# Altium project Sitara_Project_Rev_A.PrjPcb (part 3 of 3)
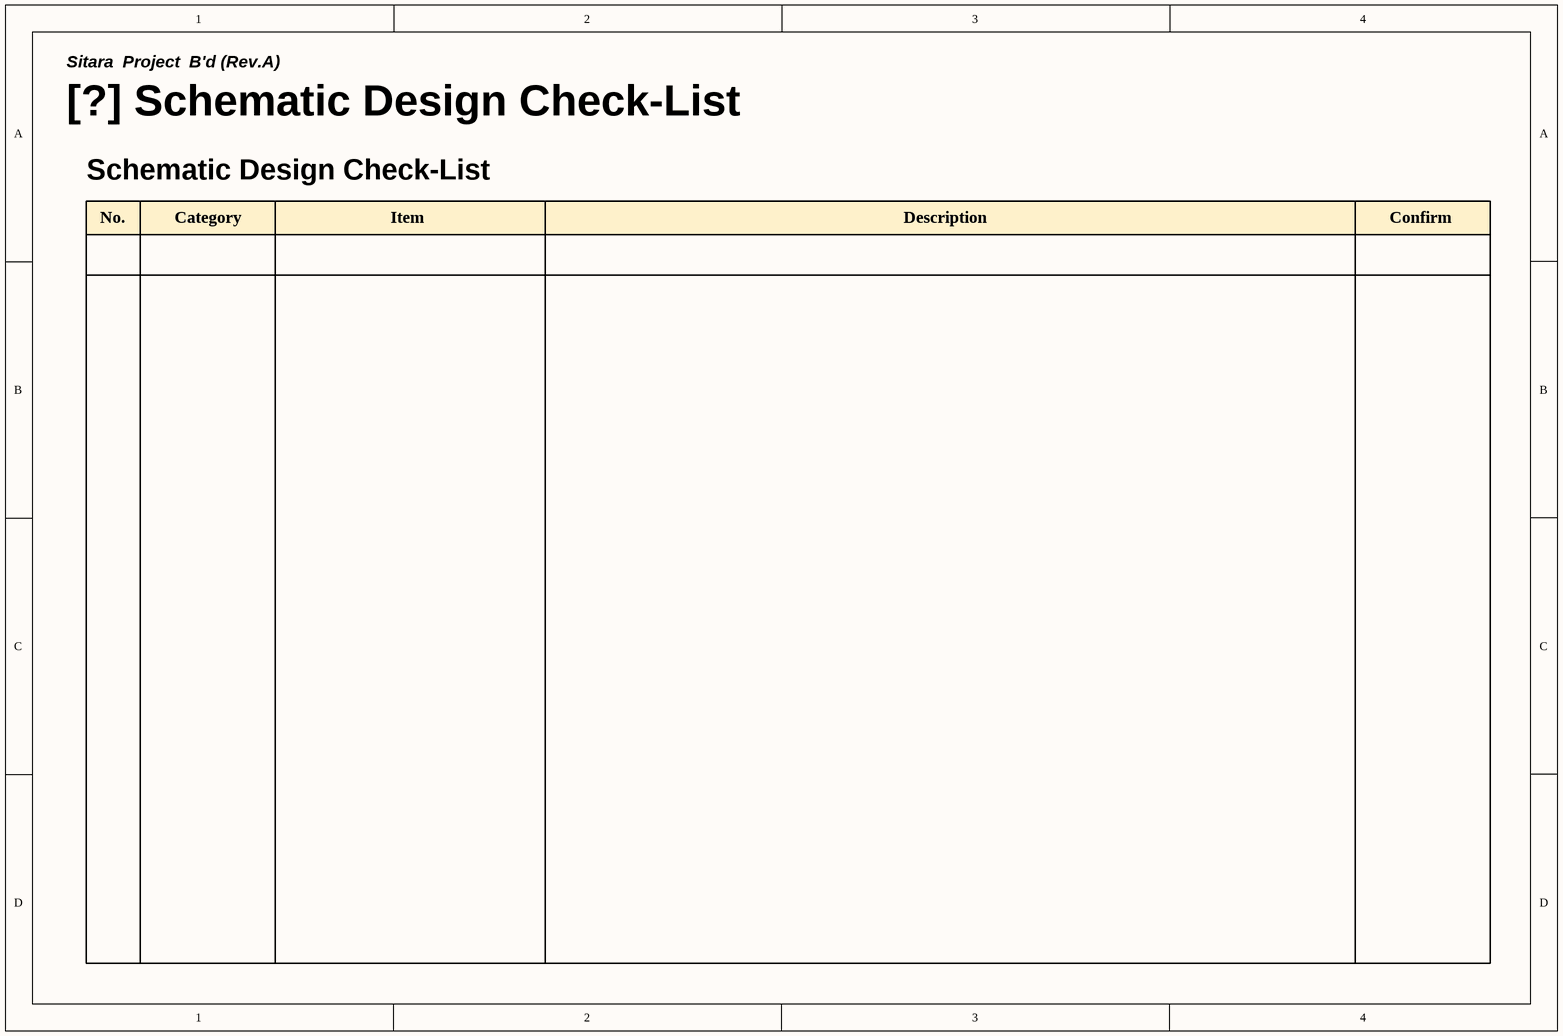
[diagram p11: Sch_Design_Check_List.SchDoc]

## Nets that join several sheets
DGND: Power (46 pins), Sitara_Power (116 pins), Sitara_AUX (34 pins), Sitara_DDR (52 pins), Sitara_IO_Bank_123 (33 pins), Sitara_IO_Bank_45 (36 pins), Sitara_IO_Bank_6 (26 pins), Sitara_Connectors (87 pins)
DP1.1V_CORE: Power (C325.2 R312.2), Sitara_Power (36 pins)
DP1.1V_MPU: Power (C324.2 R311.2), Sitara_Power (13 pins)
DP1.5V_DDR: Power (C323.2 R310.2), Sitara_Power (16 pins), Sitara_DDR (42 pins)
DP1.8V_VDDS: Power (R315.2), Sitara_Power (14 pins)
DP1.8V_VIO: Power (R313.2 U300.18), Sitara_IO_Bank_6 (U902.5)
DP1.8V_VRTC: Power (C326.2 R314.2 R327.2), Sitara_Power (C411.2 U400.D7), Sitara_AUX (C506.2 R553.1 X501.4)
DP1.8VS: Power (C328.2 R317.2), Sitara_Power (9 pins), Sitara_IO_Bank_123 (23 pins)
DP3.3VS_A: Power (6 pins), Sitara_Power (43 pins), Sitara_AUX (20 pins), Sitara_IO_Bank_123 (5 pins), Sitara_IO_Bank_45 (LED800.4), Sitara_IO_Bank_6 (R909.2)
DP3.3VS_AMS: Power (6 pins), Sitara_Connectors (6 pins)
DP3.3VS_B: Power (R336.2 R337.2), Sitara_AUX (R519.1), Sitara_IO_Bank_123 (19 pins), Sitara_IO_Bank_45 (10 pins), Sitara_IO_Bank_6 (13 pins), Sitara_Connectors (CN1002.1)
DP3.3VS_MIC: Power (5 pins), Sitara_Connectors (6 pins)
GNDADC: Sitara_Power (FB400.2 U400.E8), Sitara_AUX (C503.2 C504.2 C505.1 R545.2)
GNDOSC0: Sitara_Power (R400.1 U400.V11), Sitara_AUX (C502.1 X500.2)
GNDOSC1: Sitara_Power (R401.2 U400.A5), Sitara_AUX (C506.1 X501.2)
IN5VS: Power (10 pins), Sitara_Connectors (8 pins)
USB_5VS: Power (5 pins), Sitara_AUX (R500.1)
VDD_ADC: Sitara_Power (C409.2 FB402.2 U400.D8), Sitara_AUX (R542.2)
VDD_PLL: Sitara_Power (9 pins), Sitara_AUX (C502.2 R543.1 X500.4)
AIN0: Sitara_AUX (U400.B6), Sitara_Connectors (R1001.2)
AIN1: Sitara_AUX (U400.C7), Sitara_Connectors (R1003.2)
AIN2: Sitara_AUX (U400.B7), Sitara_Connectors (R1005.2)
AIN3: Sitara_AUX (U400.A7), Sitara_Connectors (R1007.2)
AIN4: Sitara_AUX (U400.C8), Sitara_Connectors (R1009.2)
AIN5: Sitara_AUX (U400.B8), Sitara_Connectors (R1011.2)
AIN6: Sitara_AUX (U400.A8), Sitara_Connectors (R1013.2)
AM3_GPIO0_22: Sitara_IO_Bank_123 (U400.U10), Sitara_Connectors (R1027.1)
AM3_GPIO0_23: Sitara_IO_Bank_123 (U400.T10), Sitara_Connectors (R1030.1)
AM3_GPIO0_26: Sitara_IO_Bank_123 (U400.T11), Sitara_Connectors (R1033.1)
AM3_GPIO0_27: Sitara_IO_Bank_123 (U400.U12), Sitara_Connectors (R1036.1)
AM3_GPIO1_12: Sitara_IO_Bank_123 (U400.T12), Sitara_Connectors (R1039.1)
AM3_GPIO1_13: Sitara_IO_Bank_123 (U400.R12), Sitara_Connectors (R1042.1)
AM3_GPIO1_14: Sitara_IO_Bank_123 (U400.V13), Sitara_Connectors (R1045.1)
AM3_GPIO1_15: Sitara_IO_Bank_123 (U400.U13), Sitara_Connectors (R1048.1)
AM3_GPIO_ETH_PHY_RESET: Sitara_IO_Bank_45 (R835.2 U802.1), Sitara_IO_Bank_6 (U400.E18)
AM3_I2C0_SCL: Power (R322.2), Sitara_IO_Bank_123 (R700.1 U701.6), Sitara_IO_Bank_6 (U400.C16)
AM3_I2C0_SDA: Power (R323.2), Sitara_IO_Bank_123 (R701.1 U701.5), Sitara_IO_Bank_6 (U400.C17)
AM3_I2C1_SCL: Sitara_IO_Bank_6 (U400.A16), Sitara_Connectors (R1028.2)
AM3_I2C1_SDA: Sitara_IO_Bank_6 (U400.B16), Sitara_Connectors (R1031.2)
AM3_I2C2_SCL: Sitara_IO_Bank_6 (U400.D17), Sitara_Connectors (R1029.1)
AM3_I2C2_SDA: Sitara_IO_Bank_6 (U400.D18), Sitara_Connectors (R1032.1)
AM3_PMIC_LDO_PGOOD: Power (R329.2), Sitara_AUX (U400.B5)
AM3_PMIC_nINT: Power (R330.2), Sitara_IO_Bank_6 (U400.B18)
AM3_PMIC_nWAKEUP: Power (R332.2), Sitara_AUX (U400.C5)
AM3_PMIC_PGOOD: Power (R325.2), Sitara_IO_Bank_6 (U400.B15 U902.2)
AM3_PMIC_PWR_EN: Power (R324.2), Sitara_AUX (U400.C6)
AM3_SPI1_CS0: Sitara_IO_Bank_6 (U400.C12), Sitara_Connectors (R1055.2)
AM3_SPI1_D0: Sitara_IO_Bank_6 (U400.B13), Sitara_Connectors (R1053.2)
AM3_SPI1_D1: Sitara_IO_Bank_6 (U400.D12), Sitara_Connectors (R1054.2)
AM3_SPI1_SCLK: Sitara_IO_Bank_6 (U400.A13), Sitara_Connectors (R1051.2)
AM3_STATUS_LED_B: Sitara_IO_Bank_45 (R855.1), Sitara_IO_Bank_6 (U400.R5), Sitara_Connectors (R1041.1)
AM3_STATUS_LED_G: Sitara_IO_Bank_45 (R852.1), Sitara_IO_Bank_6 (U400.U5), Sitara_Connectors (R1038.1)
AM3_STATUS_LED_R: Sitara_IO_Bank_45 (R849.1), Sitara_IO_Bank_6 (U400.V5), Sitara_Connectors (R1035.1)
AM3_UART1_RX: Sitara_IO_Bank_6 (U400.D16), Sitara_Connectors (R1037.2)
AM3_UART1_TX: Sitara_IO_Bank_6 (U400.D15), Sitara_Connectors (R1034.2)
AM3_UART2_RX: Sitara_IO_Bank_6 (U400.A17), Sitara_Connectors (R1043.2)
AM3_UART2_TX: Sitara_IO_Bank_6 (U400.B17), Sitara_Connectors (R1040.2)
AM3_UART4_RX: Sitara_IO_Bank_123 (U400.T17), Sitara_Connectors (R1049.2)
AM3_UART4_TX: Sitara_IO_Bank_123 (U400.U17), Sitara_Connectors (R1046.2)
AM3_USER_LED1: Sitara_AUX (R546.1), Sitara_IO_Bank_123 (U400.V15), Sitara_Connectors (R1044.1)
AM3_USER_LED2: Sitara_AUX (R549.1), Sitara_IO_Bank_123 (U400.U15), Sitara_Connectors (R1047.1)
AM3_USER_LED3: Sitara_AUX (R554.1), Sitara_IO_Bank_123 (U400.T15), Sitara_Connectors (R1050.1)
AM3_USER_LED4: Sitara_AUX (R557.1), Sitara_IO_Bank_123 (U400.V16), Sitara_Connectors (R1052.1)
AM3_WARM_nRESET: Sitara_IO_Bank_45 (U802.2), Sitara_IO_Bank_6 (R911.2 U400.A10 U902.4)
EXT_UART0_RX: Sitara_IO_Bank_6 (R900.1 R904.2), Sitara_Connectors (CN1002.3)
EXT_UART0_TX: Sitara_IO_Bank_6 (R903.2), Sitara_Connectors (CN1002.2)
MMC0_CD: Sitara_IO_Bank_123 (R711.2), Sitara_IO_Bank_6 (U400.C15)
MMC0_CLK: Sitara_IO_Bank_123 (R710.1), Sitara_IO_Bank_45 (U400.G17)
MMC0_CMD: Sitara_IO_Bank_123 (R712.1), Sitara_IO_Bank_45 (U400.G18)
MMC0_DAT0: Sitara_IO_Bank_123 (R713.1), Sitara_IO_Bank_45 (U400.G16)
MMC0_DAT1: Sitara_IO_Bank_123 (R714.1), Sitara_IO_Bank_45 (U400.G15)
MMC0_DAT2: Sitara_IO_Bank_123 (R715.1), Sitara_IO_Bank_45 (U400.F18)
MMC0_DAT3: Sitara_IO_Bank_123 (R716.1), Sitara_IO_Bank_45 (U400.F17)
SYS_BOOT0: Sitara_AUX (R517.1 R538.2), Sitara_IO_Bank_6 (U400.R1), Sitara_Connectors (R1000.1)
SYS_BOOT1: Sitara_AUX (R516.1 R537.2), Sitara_IO_Bank_6 (U400.R2), Sitara_Connectors (R1002.1)
SYS_BOOT2: Sitara_AUX (R515.1 R518.1 R536.2), Sitara_IO_Bank_6 (U400.R3), Sitara_Connectors (R1004.1)
SYS_BOOT3: Sitara_AUX (R514.1 R535.2), Sitara_IO_Bank_6 (U400.R4), Sitara_Connectors (R1006.1)
SYS_BOOT4: Sitara_AUX (R513.1 R534.2), Sitara_IO_Bank_6 (U400.T1), Sitara_Connectors (R1008.1)
SYS_BOOT5: Sitara_AUX (R512.1 R533.2), Sitara_IO_Bank_6 (U400.T2), Sitara_Connectors (R1010.1)
SYS_BOOT6: Sitara_AUX (R511.1 R532.2), Sitara_IO_Bank_6 (U400.T3), Sitara_Connectors (R1012.1)
SYS_BOOT7: Sitara_AUX (R510.1 R531.2), Sitara_IO_Bank_6 (U400.T4), Sitara_Connectors (R1014.1)
SYS_BOOT8: Sitara_AUX (R509.1 R530.2), Sitara_IO_Bank_6 (U400.U1), Sitara_Connectors (R1016.1)
SYS_BOOT9: Sitara_AUX (R508.1 R529.2), Sitara_IO_Bank_6 (U400.U2), Sitara_Connectors (R1018.1)
SYS_BOOT10: Sitara_AUX (R507.1 R528.2), Sitara_IO_Bank_6 (U400.U3), Sitara_Connectors (R1020.1)
SYS_BOOT11: Sitara_AUX (R506.1 R527.2), Sitara_IO_Bank_6 (U400.U4), Sitara_Connectors (R1022.1)
SYS_BOOT12: Sitara_AUX (R505.1 R526.2), Sitara_IO_Bank_6 (U400.V2), Sitara_Connectors (R1023.1)
SYS_BOOT13: Sitara_AUX (R504.1 R525.2), Sitara_IO_Bank_6 (U400.V3), Sitara_Connectors (R1024.1)
SYS_BOOT14: Sitara_AUX (R503.1 R524.2), Sitara_IO_Bank_6 (U400.V4), Sitara_Connectors (R1025.1)
SYS_BOOT15: Sitara_AUX (R502.1 R523.2), Sitara_IO_Bank_6 (U400.T5), Sitara_Connectors (R1026.1)
TIMER4: Sitara_IO_Bank_123 (U400.R7), Sitara_Connectors (R1015.2)
TIMER5: Sitara_IO_Bank_123 (U400.T6), Sitara_Connectors (R1017.2)
TIMER6: Sitara_IO_Bank_123 (U400.U6), Sitara_Connectors (R1019.2)
TIMER7: Sitara_IO_Bank_123 (U400.T7), Sitara_Connectors (R1021.2)